# EAGLE design PCB_Arduino_V2.0_PC (EAGLE 8.7.0)
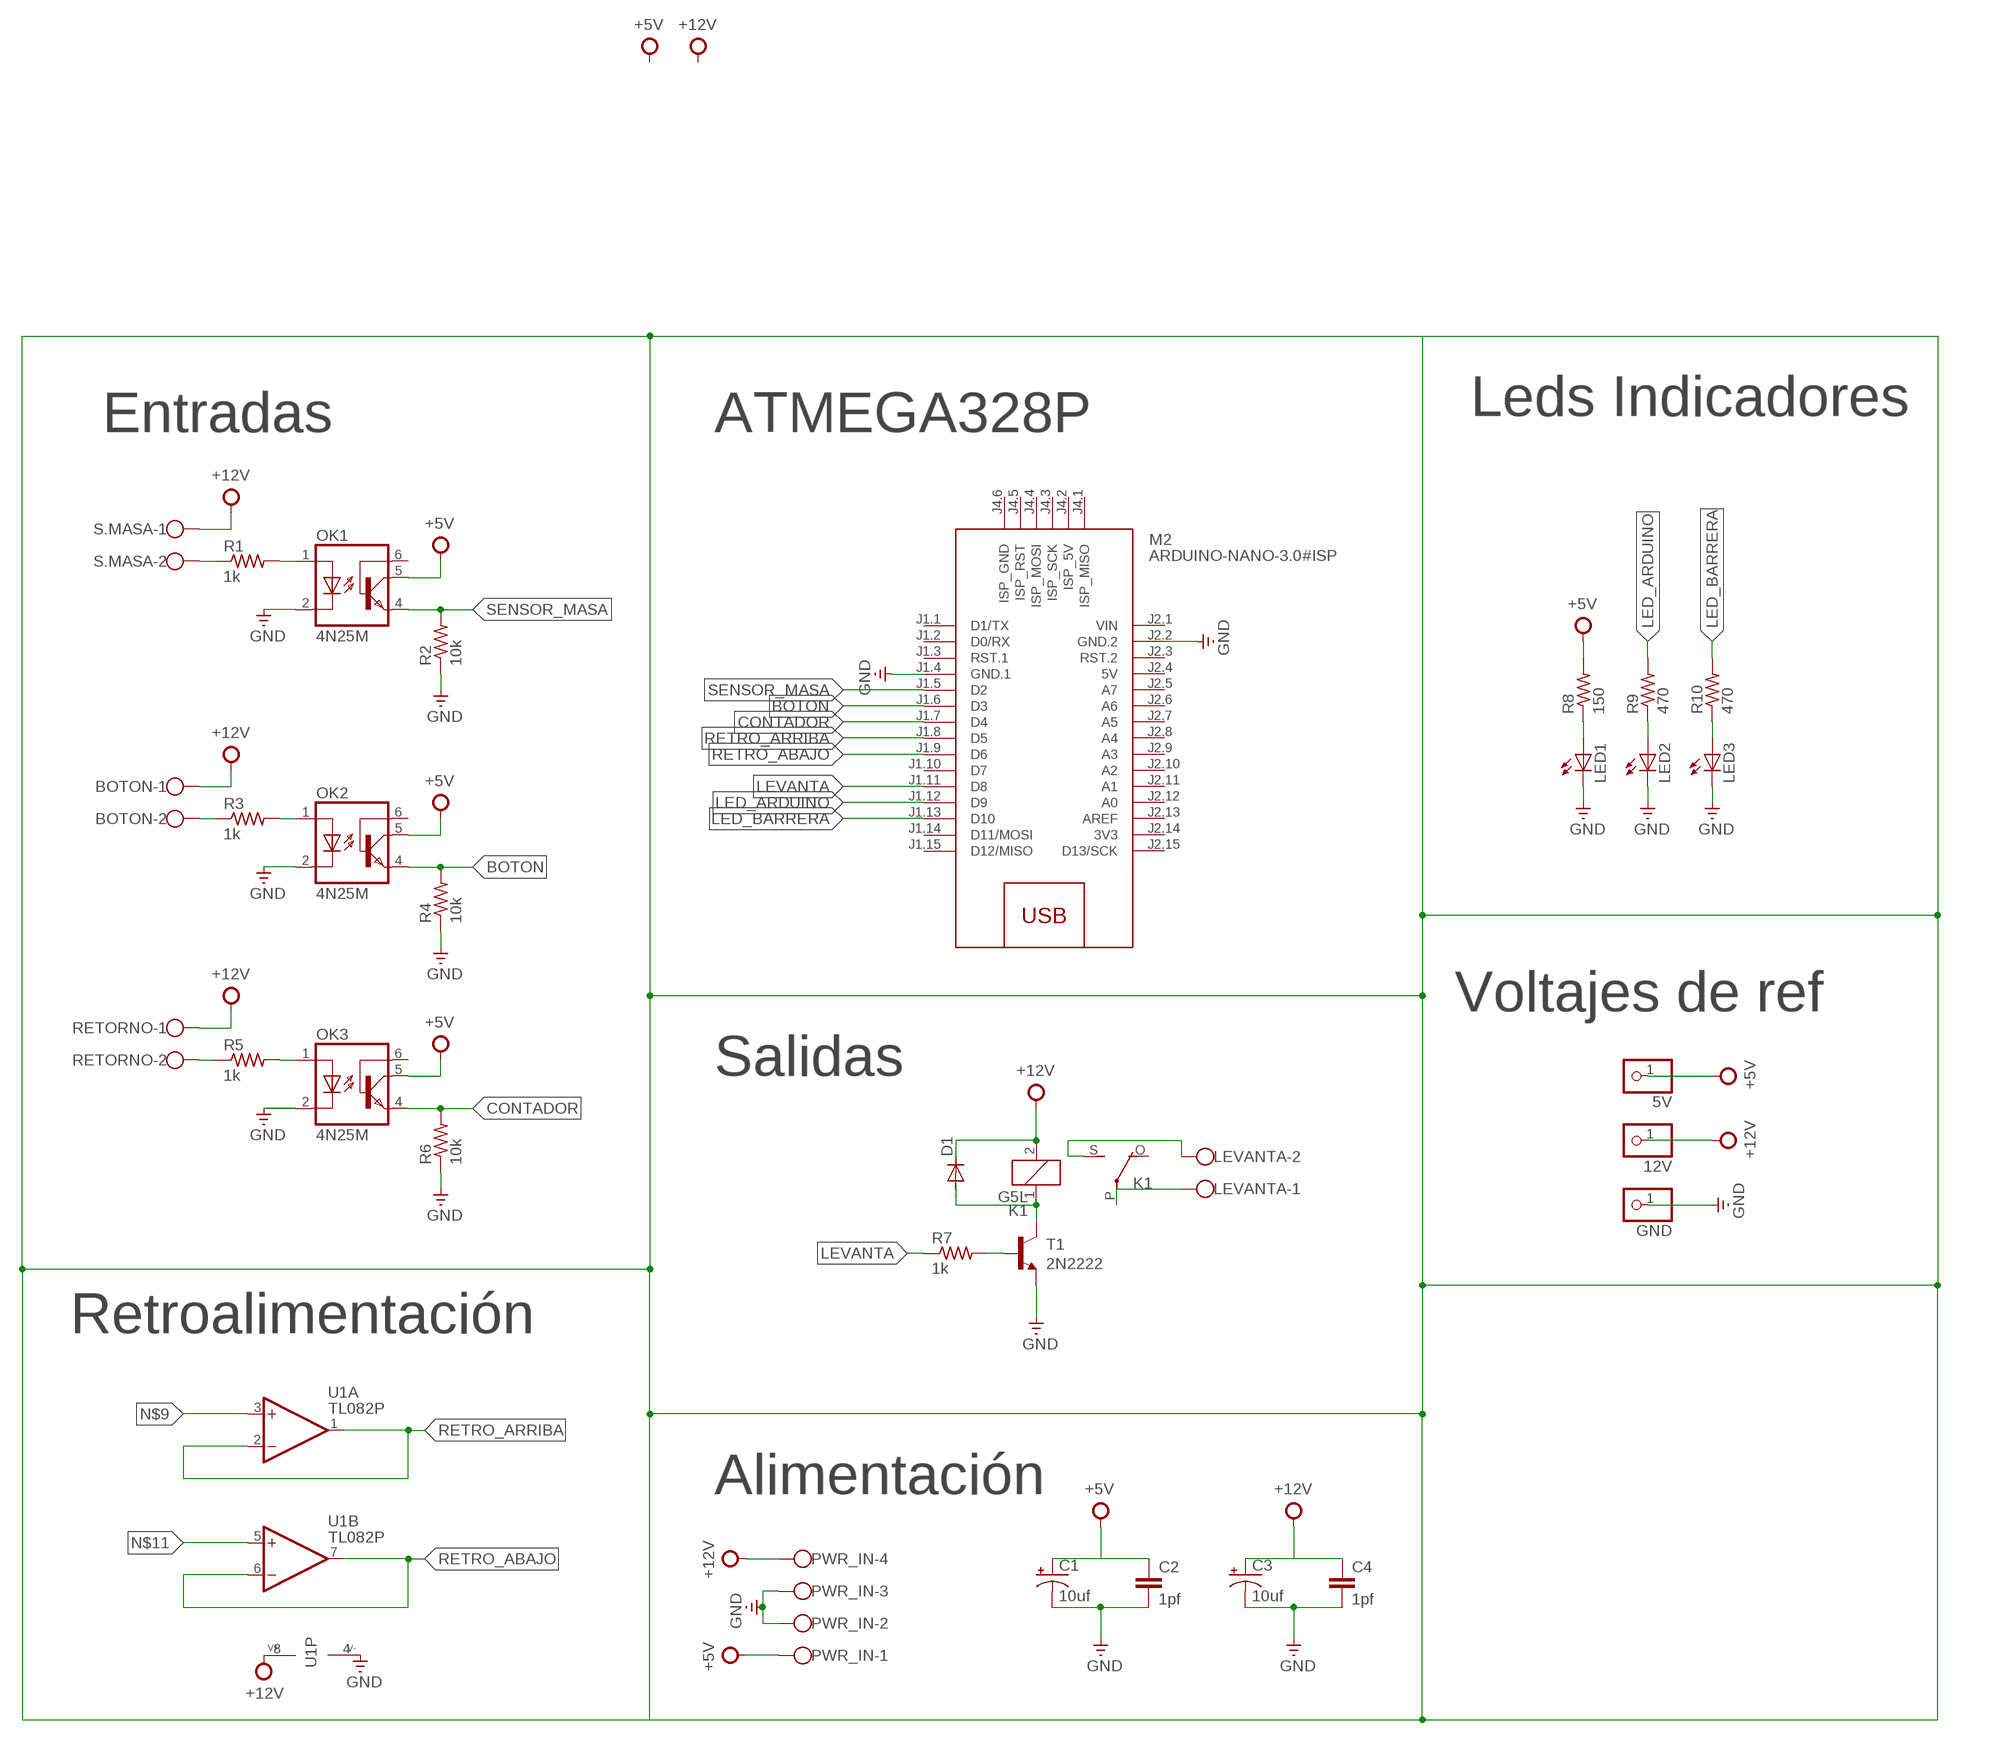
[diagram p0: schematic, sheet 1]

## Parts
5V  PINHD-1X1  [1X01]
12V  PINHD-1X1  [1X01]
BOTON  W237-102  [W237-102]
C1  10uf  CPOL-USE2.5-6  [E2,5-6]
C2  1pf  C2,5-3  [C2.5-3]
C3  10uf  CPOL-USE2.5-6  [E2,5-6]
C4  1pf  C2,5-3  [C2.5-3]
D1  1N4148DO35-7  [DO35-7]
GND  PINHD-1X1  [1X01]
K1  G5L  [G5LE]
LED1  LED5MM  [LED5MM]
LED2  LED5MM  [LED5MM]
LED3  LED5MM  [LED5MM]
LEVANTA  W237-102  [W237-102]
M2  ARDUINO-NANO-3.0#ISP  [ARDUINO-NANO-3.0#ISP]
OK1  4N25M  [DIL06]
OK2  4N25M  [DIL06]
OK3  4N25M  [DIL06]
PWR_IN  W237-4  [W237-4]
R1  1k  R-US_0207/7  [0207/7]
R2  10k  R-US_0207/7  [0207/7]
R3  1k  R-US_0207/7  [0207/7]
R4  10k  R-US_0207/7  [0207/7]
R5  1k  R-US_0207/7  [0207/7]
R6  10k  R-US_0207/7  [0207/7]
R7  1k  R-US_0207/7  [0207/7]
R8  150  R-US_0207/7  [0207/7]
R9  470  R-US_0207/7  [0207/7]
R10  470  R-US_0207/7  [0207/7]
RETORNO  W237-102  [W237-102]
S.MASA  W237-102  [W237-102]
T1  2N2222  [TO18]
U1  TL082P  [DIL08]

## Nets
+5V: 5V.1 C1.+ C2.1 OK1.5(COL) OK2.5(COL) OK3.5(COL) PWR_IN.1 R8.2
+12V: 12V.1 BOTON.1 C3.+ C4.1 D1.C K1.2 PWR_IN.4 RETORNO.1 S.MASA.1 U1.8(P:V+)
BOTON: M2.J1.6(D3) OK2.4(EMI) R4.2
CONTADOR: M2.J1.7(D4) OK3.4(EMI) R6.2
GND: C1.- C2.2 C3.- C4.2 GND.1 LED1.K(C) LED2.K(C) LED3.K(C) M2.J1.4(GND.1) M2.J2.2(GND.2) OK1.2(C) OK2.2(C) OK3.2(C) PWR_IN.2 PWR_IN.3 R2.1 R4.1 R6.1 T1.1(E) U1.4(P:V-)
LED_ARDUINO: M2.J1.12(D9) R9.2
LED_BARRERA: M2.J1.13(D10) R10.2
LEVANTA: M2.J1.11(D8) R7.1
N$1: R1.1 S.MASA.2
N$2: BOTON.2 R3.1
N$3: OK1.1(A) R1.2
N$4: OK2.1(A) R3.2
N$5: D1.A K1.1 T1.3(C)
N$6: R5.1 RETORNO.2
N$7: OK3.1(A) R5.2
N$8: R7.2 T1.2(B)
N$9: U1.3(A:+IN)
N$10: K1.S(2:S) LEVANTA.2
N$11: U1.5(B:+IN)
N$12: K1.P(2:P) LEVANTA.1
N$13: LED1.A R8.1
N$14: LED2.A R9.1
N$15: LED3.A R10.1
RETRO_ABAJO: M2.J1.9(D6) U1.6(B:-IN) U1.7(B:OUT)
RETRO_ARRIBA: M2.J1.8(D5) U1.1(A:OUT) U1.2(A:-IN)
SENSOR_MASA: M2.J1.5(D2) OK1.4(EMI) R2.2
Unconnected: K1.O(2:O) M2.J1.1(D1/TX) M2.J1.2(D0/RX) M2.J1.3(RST.1) M2.J1.10(D7) M2.J1.14(D11/MOSI) M2.J1.15(D12/MISO) M2.J2.3(RST.2) M2.J2.5(A7) M2.J2.6(A6) M2.J2.7(A5) M2.J2.8(A4) M2.J2.9(A3) M2.J2.10(A2) M2.J2.11(A1) M2.J2.12(A0) M2.J2.13(AREF) M2.J2.15(D13/SCK) M2.J4.1(ISP_MISO) M2.J4.2(ISP_5V) M2.J4.3(ISP_SCK) M2.J4.4(ISP_MOSI) M2.J4.5(ISP_RST) M2.J4.6(ISP_GND) OK1.6(BAS) OK2.6(BAS) OK3.6(BAS)

## Notes on the sheet
- Entradas | ATMEGA328P | Leds Indicadores
- Voltajes de ref
- Salidas
- Retroalimentación
- Alimentación

## Power pins joined to a net without a drawn wire
3V3: M2.J2.14(3V3)
5V: M2.J2.4(5V)
VIN: M2.J2.1(VIN)

## Library data of the parts
5V 12V GND = adafruit:PINHD-1X1: Pin header 1x1 for 0.1" spacing With round pins
BOTON LEVANTA RETORNO S.MASA = con-wago-500:W237-102: WAGO SCREW CLAMP; MPN: 237-102; OC_FARNELL: unknown; OC_NEWARK: 70K9898
C1 C3 = adafruit:CPOL-US: POLARIZED CAPACITOR, American symbol
C2 C4 = capacitor-wima:C: CAPACITOR naming: grid - package width
D1 = diode:1N4148: DIODE high speed (Philips)
K1 = relay:G5L: RELAY 1 x switch, 10 A/120 V AC, 8 A/30 V ADC, Omron; OC_FARNELL: unknown; OC_NEWARK: unknown
LED1-LED3 = adafruit:LED: LED OSRAM: - CHIPLED LG R971, LG N971, LY N971, LG Q971, LY Q971, LO R971, LY R971 LH N974, LH R974 LS Q976, LO Q976, LY Q976 LO Q996 - Hyper CHIPLED LW Q18S LB Q993, LB Q99A, LB R99A - SideLED LS A670, LO A670, LY A670, LG A670, LP A670 LB A673, LV A673, LT A673, LW A673 LH A674 LY A675 LS A676, LA A676, LO A676, LY A676, LW A676 LS A679, LY A679, LG A679 - Hyper Micro SIDELED® LS Y876, LA Y876, LO Y876, LY Y876 LT Y87S - SmartLED LW L88C, LW L88S LB L89C, LB L89S, LG L890 LS L89K, LO L89K, LY L89K LS L896, LA L896, LO L896, LY L896 - TOPLED LS T670, LO T670, LY T670, LG T670, LP T670 LSG T670, LSP T670, LSY T670, LOP T670, LYG T670 LG T671, LOG T671, LSG T671 LB T673, LV T673, LT T673, LW T673 LH T674 LS T676, LA T676, LO T676, LY T676, LB T676, LH T676, LSB T676, LW T676 LB T67C, LV T67C, LT T67C, LS T67K, LO T67K, LY T67K, LW E67C LS E67B, LA E67B, LO E67B, LY E67B, LB E67C, LV E67C, LT E67C LW T67C LS T679, LY T679, LG T679 LS T770, LO T770, LY T770, LG T770, LP T770 LB T773, LV T773, LT T773, LW T773 LH T774 LS E675, LA E675, LY E675, LS T675 LS T776, LA T776, LO T776, LY T776, LB T776 LHGB T686 LT T68C, LB T68C - Hyper Mini TOPLED® LB M676 - Mini TOPLED Santana® LG M470 LS M47K, LO M47K, LY M47K Source: http://www.osram.convergy.de/
M2 = diy-modules:ARDUINO-NANO-3.0#ISP: Arduino Nano 3.0 (and compatible devices) with ISP pads More details available here: https://www.arduino.cc/en/Main/ArduinoBoardNano Click here to find device on ebay.com <http://www.ebay.com/sch/arduino+nano>
OK1-OK3 = optocoupler:4N*?M: General Purpose 6-Pin Phototransistor Optocouplers Source: http://www.fairchildsemi.com/ds/4N/4N35-M.pdf; MPN: 4N25-M; OC_FARNELL: 1021349; OC_NEWARK: 98K9084
PWR_IN = con-wago-500:W237-4: WAGO SCREW CLAMP; OC_FARNELL: unknown; OC_NEWARK: unknown
R1-R10 = rcl:R-US_: RESISTOR, American symbol; SPICEPREFIX: R
T1 = transistor:2N2222: NPN TRANSISTOR
U1 = op-amp:TL082: JFET OP-AMP - Dual

## Board
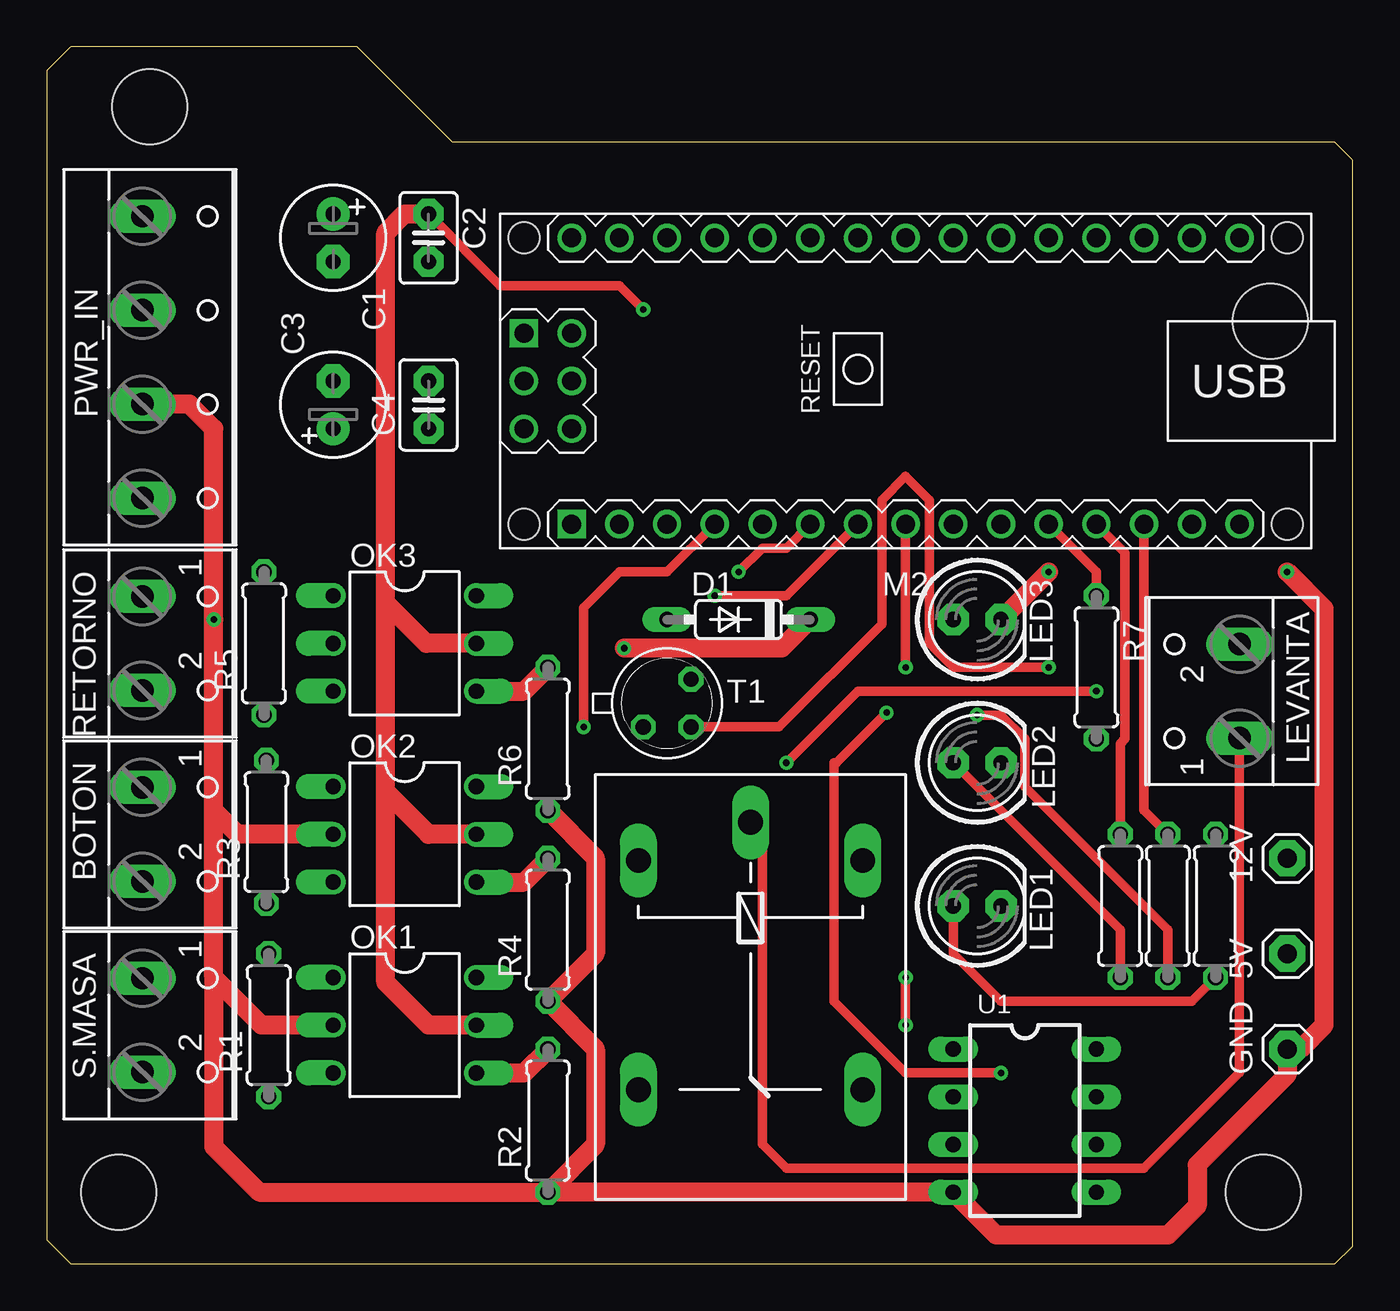
[diagram p1: board, top side]
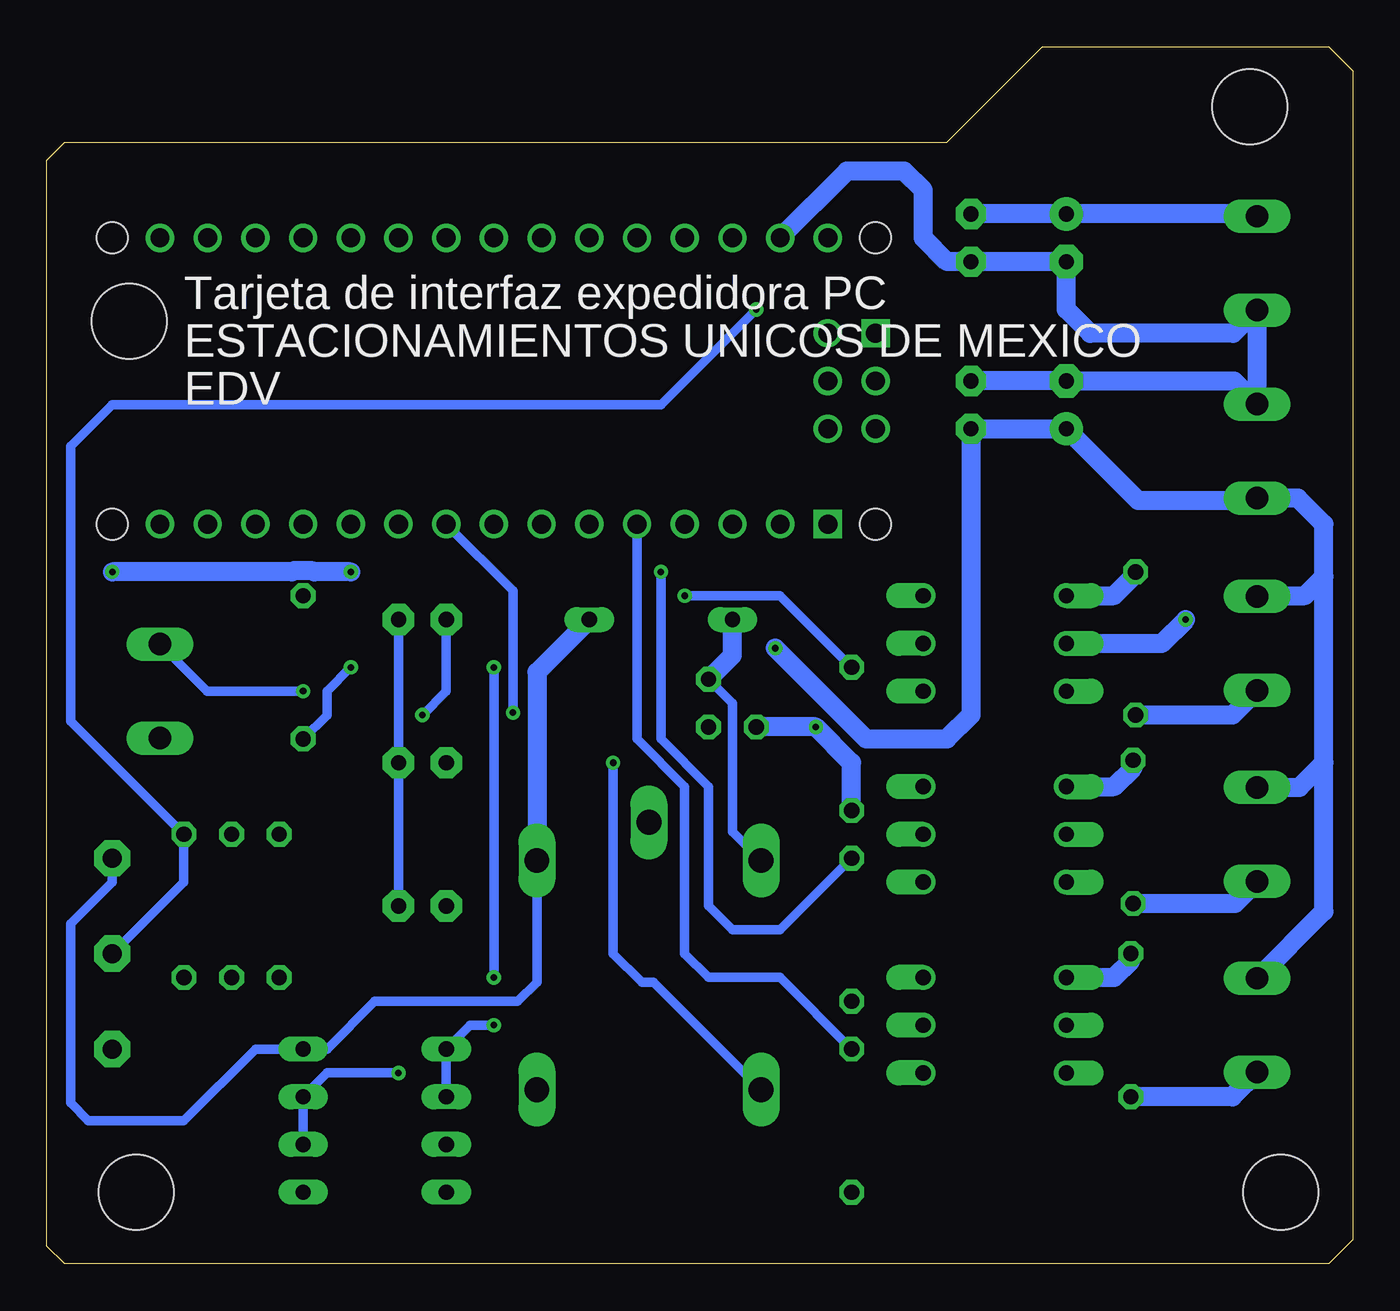
[diagram p2: board, bottom side, seen from below]

Size 69.52 x 64.77 mm. Coordinates in mm from the lower left corner, seen from the top.
Outline: 0,1.27 1.27,0 68.58,0 69.52,0.94 69.52,58.75 68.58,59.69 21.59,59.69 16.51,64.77 1.27,64.77 0,63.5 0,1.27
Copper layers (1*16): Top 0.035mm / dielectric 1.5mm / Bottom 0.035mm
Design rules "default": minimum track width 6mil, minimum drill 0.35mm, track to track 6mil, track to pad 6mil, pad to pad 6mil, via to via 6mil, smd to smd 6mil, copper to edge 40mil, drill to drill 6mil, minimum pad ring 10mil, minimum via ring 8mil, stop-mask expansion 4mil, vias tented up to drill 0mil, thermal gap 10mil
Holes 4 mm at 3.81,3.81 5.46,61.59 64.77,3.81 65.15,50.16

### Footprints (pad centres in the part's own frame; a part is rotated, then mirrored left to right if it is on the bottom)
1X01 = drill 1.016 pad 1.93 octagon: 1 0,0
W237-102 = drill 1.194 long: 1 -2.5,-1.27; 2 2.5,-1.27
E2,5-6 = drill 0.813 pad 1.778: + -1.27,0 | drill 0.813 pad 1.778 octagon: - 1.27,0
C2.5-3 = drill 0.813 pad 1.6 octagon: 1 -1.27,0; 2 1.27,0
DO35-7 = drill 0.813 long: A 3.81,0; C -3.81,0
G5LE = drill 1.321 long: 1 -7.493,-5.969; 2 -7.493,5.969; O 4.699,5.969; P -9.525,0; S 4.699,-5.969
LED5MM = drill 0.813 pad 1.676 octagon: A -1.27,0; K 1.27,0
ARDUINO-NANO-3.0#ISP = drill 1 square: J1.1 17.78,7.62; J4.1 20.32,-2.54 | drill 1: J1.2 15.24,7.62; J1.3 12.7,7.62; J1.4 10.16,7.62; J1.5 7.62,7.62; J1.6 5.08,7.62; J1.7 2.54,7.62; J1.8 0,7.62; J1.9 -2.54,7.62; J1.10 -5.08,7.62; J1.11 -7.62,7.62; J1.12 -10.16,7.62; J1.13 -12.7,7.62; J1.14 -15.24,7.62; J1.15 -17.78,7.62; J2.1 17.78,-7.62; J2.2 15.24,-7.62; J2.3 12.7,-7.62; J2.4 10.16,-7.62; J2.5 7.62,-7.62; J2.6 5.08,-7.62; J2.7 2.54,-7.62; J2.8 0,-7.62; J2.9 -2.54,-7.62; J2.10 -5.08,-7.62; J2.11 -7.62,-7.62; J2.12 -10.16,-7.62; J2.13 -12.7,-7.62; J2.14 -15.24,-7.62; J2.15 -17.78,-7.62; J4.2 17.78,-2.54; J4.3 20.32,0; J4.4 17.78,0; J4.5 20.32,2.54; J4.6 17.78,2.54 | hole 1.651: -20.32,7.62; -20.32,-7.62; 20.32,-7.62; 20.32,7.62
DIL06 = drill 0.813 offset: 1 -2.54,-3.81; 2 0,-3.81; 3 2.54,-3.81; 4 2.54,3.81; 5 0,3.81; 6 -2.54,3.81
W237-4 = drill 1.194 long: 1 -7.5,-1.27; 2 -2.5,-1.27; 3 2.5,-1.27; 4 7.5,-1.27
0207/7 = drill 0.813 octagon: 1 -3.81,0; 2 3.81,0
TO18 = drill 0.813 octagon: 1 -1.27,-1.27; 2 1.27,-1.27; 3 1.27,1.27
DIL08 = drill 0.813 long: 1 -3.81,-3.81; 2 -1.27,-3.81; 3 1.27,-3.81; 4 3.81,-3.81; 5 3.81,3.81; 6 1.27,3.81; 7 -1.27,3.81; 8 -3.81,3.81

### Placement (x,y rotation side)
5V  66.04,16.51 90 top
12V  66.04,21.59 90 top
BOTON  6.35,22.86 270 top
C1  15.24,54.61 270 top
C2  20.32,54.61 270 top
C3  15.24,45.72 90 top
C4  20.32,45.72 90 top
D1  36.83,34.29 180 top
GND  66.04,11.43 90 top
K1  37.47,13.97 270 top
LED1  49.53,19.05 0 top
LED2  49.53,26.67 0 top
LED3  49.53,34.29 0 top
LEVANTA  62.23,30.48 90 top
M2  45.72,46.99 180 top
OK1  19.05,12.7 270 top
OK2  19.05,22.86 270 top
OK3  19.05,33.02 270 top
PWR_IN  6.35,48.26 270 top
R1  11.81,12.7 90 top
R2  26.67,7.62 90 top
R3  11.68,22.99 90 top
R4  26.67,17.78 90 top
R5  11.56,33.02 90 top
R6  26.67,27.94 90 top
R7  55.88,31.75 270 top
R8  62.23,19.05 90 top
R9  57.15,19.05 90 top
R10  59.69,19.05 90 top
RETORNO  6.35,33.02 270 top
S.MASA  6.35,12.7 270 top
T1  33.02,29.84 0 top
U1  52.07,7.62 270 top

### Tracks (layer width: path | path; a pad name or v marks a point on that pad's centre or on a via)
+5V  (via drill 0.35)
  Top 0.508: v31.75,50.8 30.48,52.07 24.13,52.07 C2.1
  Top 1.016: OK3.5 20.19,33.02 18.03,35.18 | 18.03,35.18 18.03,54.86 19.05,55.88 C2.1 | OK1.5 20.32,12.7 18.03,14.99 18.03,25.15 | 18.03,25.15 18.03,35.18 | OK2.5 20.32,22.86 18.03,25.15
  Bottom 0.508: 5V.1 62.23,20.32 R8.2 68.25,28.88 68.25,43.51 66.04,45.72 36.83,45.72 v31.75,50.8
  Bottom 1.016: PWR_IN.1 5.2,55.88 C1.+ C2.1
+12V  (via drill 0.35)
  Top 1.016: D1.C 39.12,32.77 v30.73,32.77
  Bottom 0.508: 12V.1 66.04,20.32 68.25,18.11 68.25,8.56 67.31,7.62 62.23,7.62 58.42,11.43 U1.8 54.61,11.43 52.07,13.97 44.45,13.97 43.43,14.99 K1.2
  Bottom 1.016: S.MASA.1 1.52,18.76 1.52,26.67 | 1.52,26.67 1.52,36.58 | 1.52,36.58 1.52,39.37 2.91,40.76 PWR_IN.4 5.2,40.64 11.43,40.64 C3.+ C4.1 20.32,29.21 21.59,27.94 25.91,27.94 v30.73,32.77 | BOTON.1 2.83,25.36 1.52,26.67 | RETORNO.1 5.04,35.56 2.54,35.56 1.52,36.58 | D1.C 43.43,31.5 K1.2
BOTON  (via drill 0.35)
  Top 0.508: v36.83,36.83 38.1,38.1 39.37,38.1 M2.J1.6
  Top 1.016: OK2.4 25.4,20.32 R4.2
  Bottom 0.508: R4.2 30.48,17.78 33.02,17.78 34.29,19.05 34.29,25.4 36.83,27.94 v36.83,36.83
CONTADOR  (via drill 0.35)
  Top 0.508: v35.56,35.56 39.37,35.56 M2.J1.7
  Top 1.016: OK3.4 25.4,30.48 R6.2
  Bottom 0.508: R6.2 30.48,35.56 v35.56,35.56
GND  (via drill 0.35)
  Top 0.508: M2.J1.4 33.02,36.83 30.48,36.83 28.57,34.92 v28.57,28.57
  Top 1.016: PWR_IN.3 7.58,45.76 8.89,44.45 v8.89,34.29 8.89,24.13 | OK1.2 11.43,12.7 8.89,15.24 | 8.89,15.24 8.89,24.13 | OK2.2 10.16,22.86 8.89,24.13 | R2.1 11.3,3.81 8.89,6.22 8.89,15.24 | R2.1 29.21,6.35 29.21,11.43 R4.1 29.21,16.51 29.21,21.59 R6.1 | R2.1 U1.4 50.55,1.52 59.69,1.52 61.25,3.08 61.25,5.27 66.04,10.06 GND.1 66.73,11.43 68,12.7 68,29.21 68,34.87 v66.04,36.83 | LED3.K v53.34,36.83
  Bottom 0.508: LED3.K LED2.K LED1.K
  Bottom 1.016: C4.2 C3.- 6.31,46.99 PWR_IN.3 PWR_IN.2 5.12,50.76 6.35,49.53 13.97,49.53 15.24,50.8 C1.- C2.2 21.59,53.34 22.86,54.61 22.86,57.15 23.88,58.17 26.92,58.17 M2.J2.2 | OK3.2 10.16,33.02 v8.89,34.29 | R6.1 26.67,26.67 v28.57,28.57 T1.1 | v53.34,36.83 55.28,36.83 55.33,36.88 56.43,36.88 56.48,36.83 v66.04,36.83
LED_ARDUINO
  Top 0.508: M2.J1.12 57.4,37.85 57.4,27.94 57.15,27.69 R9.2
LED_BARRERA
  Top 0.508: R10.2 58.42,24.13 M2.J1.13
LEVANTA
  Top 0.508: M2.J1.11 55.88,36.83 R7.1
N$1
  Bottom 1.016: S.MASA.2 6.39,8.89 R1.1
N$2
  Bottom 1.016: BOTON.2 6.26,19.18 R3.1
N$3
  Bottom 1.016: OK1.1 12.7,15.24 11.81,16.13 R1.2
N$4
  Bottom 1.016: OK2.1 12.7,25.4 11.68,26.42 R3.2
N$5
  Bottom 0.508: K1.1 33.02,22.99 33.02,29.84 T1.3
  Bottom 1.016: T1.3 33.02,32.38 D1.A
N$6
  Bottom 1.016: RETORNO.2 6.39,29.21 R5.1
N$7
  Bottom 1.016: OK3.1 12.7,35.56 11.56,36.7 R5.2
N$8  (via drill 0.35)
  Top 0.508: v53.34,31.75 48.26,31.75 46.99,33.02 46.99,40.64 45.72,41.91 44.45,40.64 44.45,34.04 38.99,28.57 T1.2
  Bottom 0.508: R7.2 54.61,29.21 54.61,30.48 v53.34,31.75
N$10  (via drill 0.35)
  Top 0.508: v39.37,26.67 43.18,30.48 v55.88,30.48
  Bottom 0.508: v55.88,30.48 61,30.48 LEVANTA.2 | v39.37,26.67 39.37,16.51 37.85,14.99 37.21,14.99 K1.S
N$12
  Top 0.508: K1.P 38.1,22.86 38.1,6.35 39.37,5.08 58.42,5.08 63.5,10.16 LEVANTA.1
N$13
  Top 0.508: R8.1 60.96,13.97 50.8,13.97 48.26,16.51 LED1.A
N$14
  Top 0.508: LED2.A 57.15,17.78 R9.1
N$15  (via drill 0.35)
  Top 0.508: R10.1 59.69,17.78 52.07,25.4 52.07,27.94 50.8,29.21 v49.53,29.21
  Bottom 0.508: v49.53,29.21 48.26,30.48 LED3.A
RETRO_ABAJO  (via drill 0.35)
  Top 0.508: v50.8,10.16 45.72,10.16 41.91,13.97 41.91,26.67 42.04,26.67 v44.7,29.34
  Bottom 0.508: U1.6 U1.7 54.61,10.16 v50.8,10.16 | v44.7,29.34 44.7,35.81 M2.J1.9
RETRO_ARRIBA  (via drill 0.35)
  Top 0.508: M2.J1.8 v45.72,31.75 | v45.72,15.24 v45.72,12.7
  Bottom 0.508: v45.72,31.75 v45.72,15.24 | v45.72,12.7 46.99,12.7 U1.1 U1.2
SENSOR_MASA
  Top 1.016: OK1.4 25.4,10.16 R2.2
  Bottom 0.508: R2.2 30.48,15.24 34.29,15.24 35.56,16.51 35.56,25.4 38.1,27.94 M2.J1.5

### Text on the board
bPlace: Tarjeta de interfaz expedidora PC | ESTACIONAMIENTOS UNICOS DE MEXICO | EDV